# EasyEDA schematic DRONE_ESP_SHIELD.json
TITLE: DRONE_ESP_SHIELD; REV: 0.1; Date: 2023-06-03; Sheet: 1/1; Company: QUB
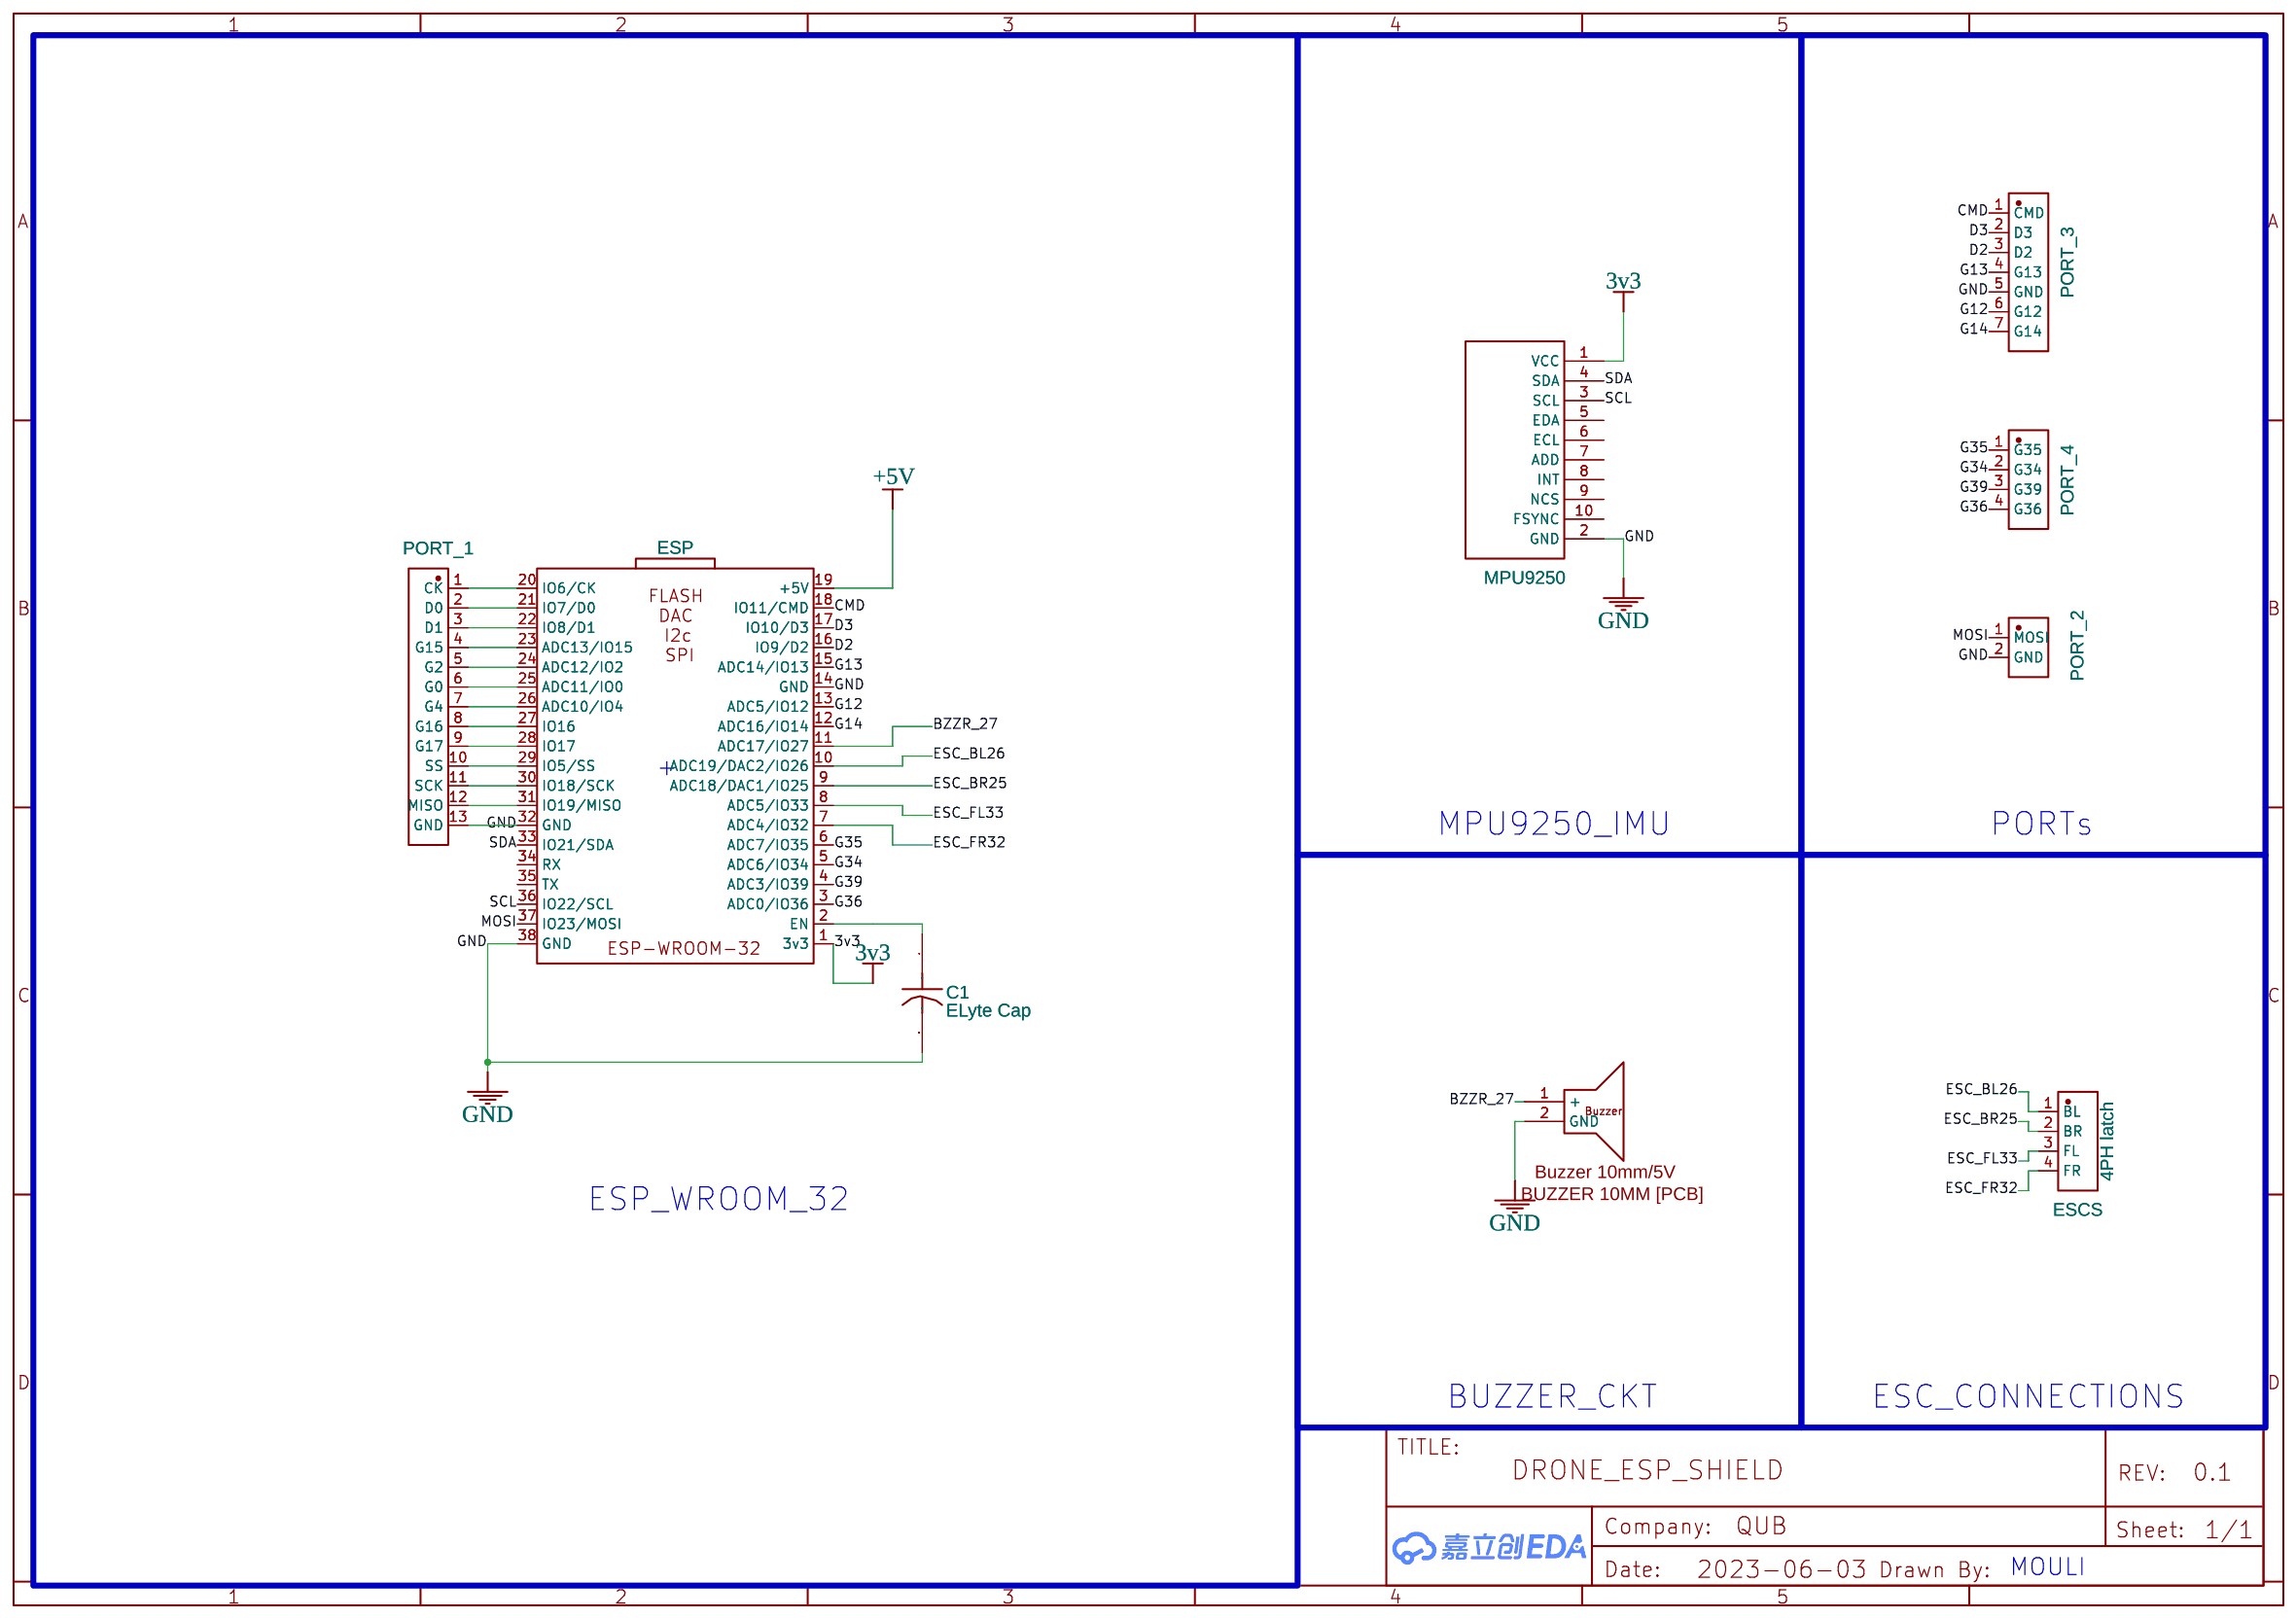
[diagram p0: schematic sheet]

## Parts
BUZZER  Buzzer 10mm/5V  [BUZZER 10MM [PCB]]
C1  ELyte Cap  [ELECTROLITIC CAPACITOR]
ESCS  4PH latch  [HDR-TH_4P-P2.54-V-F]
ESP  ESP-WROOM-32D 38 Pins  [ESP32-WROOM-32 V4]
MPU9250  MPU9250  [MPU9250 MODULE]
PORT_1  EXT_PORT  [HDR-TH_13P-P2.54-V-F]
PORT_2  HDR102  [HDR-TH_2P-P2.54-V-M-3]
PORT_3  PZ254-1-07-Z-C  [HDR-TH_7P-P2.54-V-M]
PORT_4  0022285044  [HDR-TH_4P-P2.54-V-M-1]

## Library data of the parts
BUZZER = Buzzer 10mm/5V: Supplier: SHIVRAM; Manufacturer: SHIVRAM; Contributor: Scikraft; Package Display: Yes
C1 = Electrolitic Capacitor: Contributor: dbrancam
ESCS = A2541HWV-4P_C5176037: Supplier: LCSC; Supplier Part: C5176037; Manufacturer: CJT(长江连接器); Manufacturer Part: A2541HWV-4P; link: https://atta.szlcsc.com/upload/public/pdf/source/20220916/7A4096DE70FDAC144DF90D6CBDE9C2A1.pdf; Contributor: lcsc; JLCPCB Part Class: Extended Part
ESP = ESP-WROOM-32D 38 Pins: Manufacturer: Hiletgo; Manufacturer Part: ESP-WROOM-32; Supplier: Amazon; Supplier Part: ESP-WROOM-32; link: https://www.amazon.com/gp/product/B0718T232Z/ref=ppx_yo_dt_b_search_asin_title?ie=UTF8&psc=1#descriptionAndDetails; Contributor: xjplguy
MPU9250 = MPU9250 MODULE: Contributor: gnatyuk.yevg
PORT_1 = PZ254-1-13-Z-8.5KK: Supplier: LCSC; Supplier Part: C3012215; Manufacturer: HCTL(华灿天禄); link: https://atta.szlcsc.com/upload/public/pdf/source/20220518/2B6B130E67DEF018154FFE5EFF427855.pdf; Contributor: lcsc
PORT_2 = HDR102: Supplier: LCSC; Supplier Part: C9900001420; Manufacturer: null; JLCPCB Part Class: Extended Part; link: https://item.szlcsc.com/469513.html; Contributor: LCSC
PORT_3 = PZ254-1-07-Z-C: Supplier: LCSC; Supplier Part: C5156434; Manufacturer: HCTL(华灿天禄); link: https://atta.szlcsc.com/upload/public/pdf/source/20220902/6A77F1CA17172E97499F3A4004CED624.pdf; Contributor: lcsc
PORT_4 = 0022285044: Supplier: LCSC; Supplier Part: C9900016049; Manufacturer: null; JLCPCB Part Class: Extended Part; Contributor: lcsc

## Nets
3v3: ESP.1(3v3) MPU9250.1(VCC)
+5V: ESP.19(+5V)
GND: BUZZER.2(GND) C1.2 ESP.14(GND) ESP.32(GND) ESP.38(GND) MPU9250.2(GND) PORT_1.13(GND) PORT_2.2(GND) PORT_3.5(GND)
BZZR_27: BUZZER.1(+) ESP.11(ADC17/IO27)
CMD: ESP.18(IO11/CMD) PORT_3.1(CMD)
D2: ESP.16(IO9/D2) PORT_3.3(D2)
D3: ESP.17(IO10/D3) PORT_3.2(D3)
ESC_BL26: ESCS.1(BL) ESP.10(ADC19/DAC2/IO26)
ESC_BR25: ESCS.2(BR) ESP.9(ADC18/DAC1/IO25)
ESC_FL33: ESCS.3(FL) ESP.8(ADC5/IO33)
ESC_FR32: ESCS.4(FR) ESP.7(ADC4/IO32)
G12: ESP.13(ADC5/IO12) PORT_3.6(G12)
G13: ESP.15(ADC14/IO13) PORT_3.4(G13)
G14: ESP.12(ADC16/IO14) PORT_3.7(G14)
G34: ESP.5(ADC6/IO34) PORT_4.2(G34)
G35: ESP.6(ADC7/IO35) PORT_4.1(G35)
G36: ESP.3(ADC0/IO36) PORT_4.4(G36)
G39: ESP.4(ADC3/IO39) PORT_4.3(G39)
MOSI: ESP.37(IO23/MOSI) PORT_2.1(MOSI)
SCL: ESP.36(IO22/SCL) MPU9250.3(SCL)
SDA: ESP.33(IO21/SDA) MPU9250.4(SDA)
Net-(C1-1): C1.1 ESP.2(EN)
Net-(ESP-20): ESP.20(IO6/CK) PORT_1.1(CK)
Net-(ESP-21): ESP.21(IO7/D0) PORT_1.2(D0)
Net-(ESP-22): ESP.22(IO8/D1) PORT_1.3(D1)
Net-(ESP-23): ESP.23(ADC13/IO15) PORT_1.4(G15)
Net-(ESP-24): ESP.24(ADC12/IO2) PORT_1.5(G2)
Net-(ESP-25): ESP.25(ADC11/IO0) PORT_1.6(G0)
Net-(ESP-26): ESP.26(ADC10/IO4) PORT_1.7(G4)
Net-(ESP-27): ESP.27(IO16) PORT_1.8(G16)
Net-(ESP-28): ESP.28(IO17) PORT_1.9(G17)
Net-(ESP-29): ESP.29(IO5/SS) PORT_1.10(SS)
Net-(ESP-30): ESP.30(IO18/SCK) PORT_1.11(SCK)
Net-(ESP-31): ESP.31(IO19/MISO) PORT_1.12(MISO)

Not connected (* = marked no-connect by the designer): ESP 34(RX) 35(TX); MPU9250 5(EDA) 6(ECL) 7(ADD) 8(INT) 9(NCS) 10(FSYNC)

## Notes on the sheet
- +
- MPU9250_IMU
- PORTs
- ESP_WROOM_32
- BUZZER_CKT
- ESC_CONNECTIONS
- MOULI
